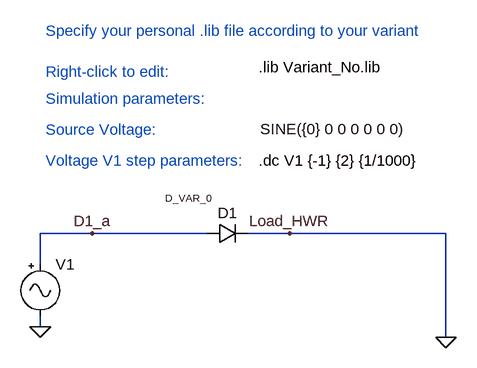
[diagram p0: schematic Practice1_Task_Template.asc]
Practice1_Task_Template.asc, the LTspice schematic file:
Version 4
SHEET 1 7368 964
WIRE -2192 -576 -2272 -576
WIRE -2016 -576 -2192 -576
WIRE -1888 -576 -1952 -576
WIRE -1648 -576 -1888 -576
WIRE -2272 -528 -2272 -576
WIRE -2272 -432 -2272 -448
WIRE -1648 -416 -1648 -576
FLAG -1648 -416 0
FLAG -1888 -576 Load_HWR
FLAG -2272 -432 0
FLAG -2192 -576 D1_a
SYMBOL Misc\\signal -2272 -544 R0
WINDOW 123 0 0 Left 0
WINDOW 39 0 0 Left 0
WINDOW 3 338 -193 Left 2
SYMATTR Value SINE({0} 0 0 0 0 0 0)
SYMATTR InstName V1
SYMBOL diode -2016 -560 R270
WINDOW 0 32 32 VTop 2
WINDOW 3 81 -28 VBottom 1
SYMATTR InstName D1
SYMATTR Value D_VAR_0
TEXT -1936 -688 Left 2 !.dc V1 {-1} {2} {1/1000}
TEXT -1936 -832 Left 2 !.lib Variant_No.lib
TEXT -2264 -888 Left 2 ;Specify your personal .lib file according to your variant\n \nRight-click to edit:
TEXT -2264 -784 Left 2 ;Simulation parameters:
TEXT -2264 -736 Left 2 ;Source Voltage:
TEXT -2264 -688 Left 2 ;Voltage V1 step parameters:

The netlist it stands for:
* Practice1_Task_Template.asc
V1 D1_a 0 SINE({0} 0 0 0 0 0 0)
D1 D1_a 0 D_VAR_0
.model D D
.lib standard.dio
.dc V1 {-1} {2} {1/1000}
.lib Variant_No.lib
* Specify your personal .lib file according to your variant
* Right-click to edit:
* Simulation parameters:
* Source Voltage:
* Voltage V1 step parameters:
.backanno
.end